# Altium project BalEv.PrjPcb
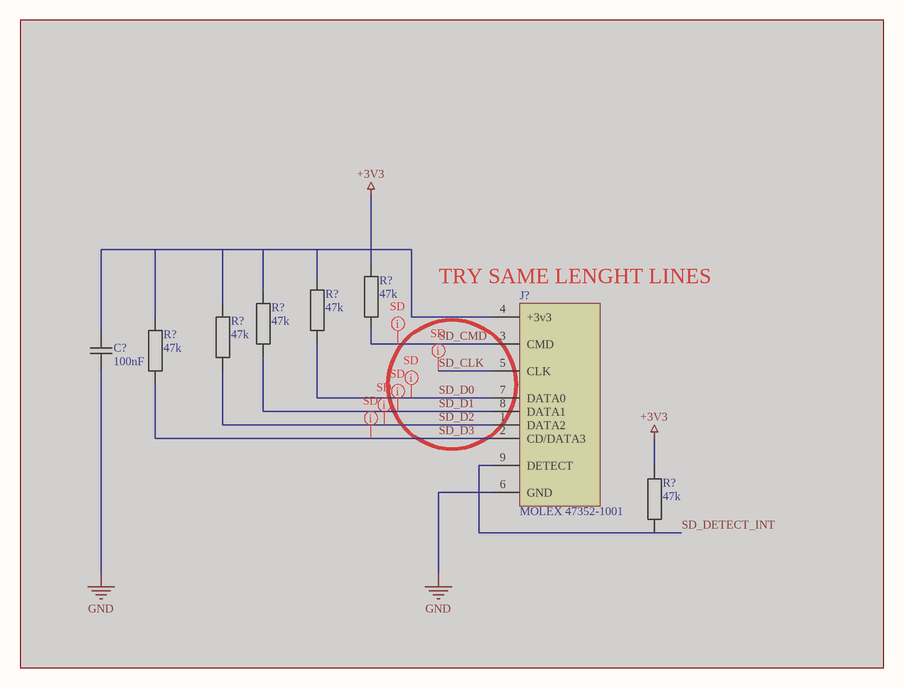
[diagram p0: BalEv_SD_card_v1_0.SchDoc]
PcbDate: 25.05.2022; PcbDesigner: gas; PcbRevision: 1.0; SchematicDate: 17.01.2022; SchematicDesigner: anx/sap; SchematicRevision: 1.0a
8 sheets, 306 parts. Net scope: global (net labels, ports and power ports of the same name join across sheets).
Board file: BalEv.PcbDoc
Sheets:
  BalEv_SD_card_v1_0.SchDoc
  BalEv_STM_v1_0.SchDoc
  BalEv_USB_v1_0.SchDoc
  BalEv_FPTG_POW_COFIG_v1_0.SchDoc
  BalEv_ADC_v1_0.SchDoc
  BalEv_AINa_v1_0.SchDoc
  BalEv_AINb_v1_0.SchDoc
  BalEv_FPTG_IO_v1_0.SchDoc

## Sheet BalEv_SD_card_v1_0.SchDoc
size A4; CompanyName: HESSO; Address1: Route du Rawyl 47; Address2: 1950 Sion; Address3: Switzerland; DocumentNumber: 5; SheetNumber: 1; SheetTotal: 8; PageSetup: Record=PageOptions|CenterHorizontal=True|CenterVertical=True|PrintScale=1.00|XCorrection=1.00|YCorrection=1.00|PrintKind=1|BorderSize=5000000|LeftOffset=0|BottomOffset=0|Orientation=2|PaperLength=1000|PaperWidth=1000|Scale=100|PaperSource=15|PrintQuality=1200|MediaType=1|DitherType=10|PrintScaleMode=1|PaperKind=A4|PaperIndex=9; ProjectName: Project Name

### Parts
(Parts that share a designator on the sheet are numbered #1, #2 ... from top to bottom, then left to right.)
C?#1  100nF  [CAPACITOR 1005 REFLOW]  (masked out: inside a compile mask, not in the netlist)
J?#1  MOLEX 47352-1001  [SD MICRO MOLEX 47352-1001]  (masked out: inside a compile mask, not in the netlist)
R?#1  47k  [RESISTOR 1005 REFLOW]  (masked out: inside a compile mask, not in the netlist)
R?#2  47k  [RESISTOR 1005 REFLOW]  (masked out: inside a compile mask, not in the netlist)
R?#3  47k  [RESISTOR 1005 REFLOW]  (masked out: inside a compile mask, not in the netlist)
R?#4  47k  [RESISTOR 1005 REFLOW]  (masked out: inside a compile mask, not in the netlist)
R?#5  47k  [RESISTOR 1005 REFLOW]  (masked out: inside a compile mask, not in the netlist)
R?#6  47k  [RESISTOR 1005 REFLOW]  (masked out: inside a compile mask, not in the netlist)

### Layout directives
net class SD; rule Matched Net Lengths [Tolerance = 1mm]: (no net found under the mark)

### Notes on the sheet
- (near J?#1) TRY SAME LENGHT LINES
- Date :
- Revision :
- Sheet
- of
- Design by :

### Library data of the parts
C?#1 = Capacitor: Value: 100nF; STOCK: NO
J?#1 = SD-MICRO MOLEX 47352-1001: SD Card  Micro 47352-1001; Value: MOLEX 47352-1001; STOCK: YES
R?#1-R?#6 = Resistor: Value: 47k; STOCK: NO

## Sheet BalEv_STM_v1_0.SchDoc
size A4; CompanyName: HESSO; Address1: Route du Rawyl 47; Address2: 1950 Sion; Address3: Switzerland; DocumentNumber: 3; SheetNumber: 2; SheetTotal: 8; PageSetup: Record=PageOptions|CenterHorizontal=True|CenterVertical=True|PrintScale=1.00|XCorrection=1.00|YCorrection=1.00|PrintKind=1|BorderSize=5000000|LeftOffset=0|BottomOffset=0|Orientation=2|PaperLength=1000|PaperWidth=1000|Scale=100|PaperSource=15|PrintQuality=1200|MediaType=1|DitherType=10|PrintScaleMode=1|PaperKind=A4|PaperIndex=9; ProjectName: Project Name
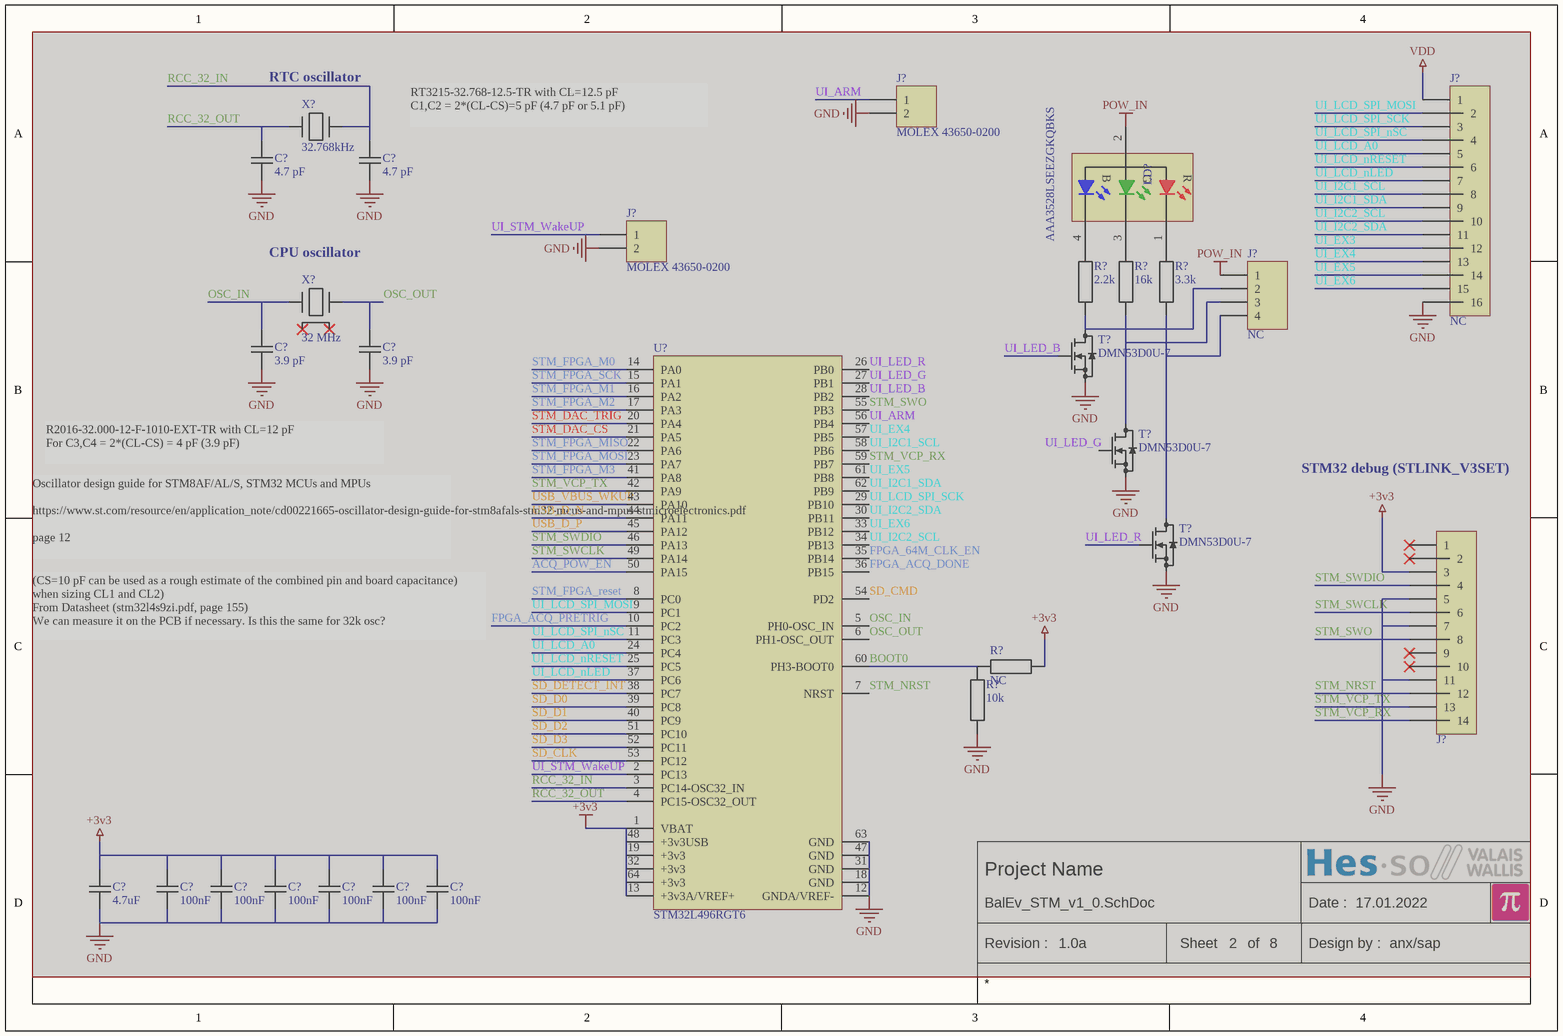
[diagram p1: BalEv_STM_v1_0.SchDoc]

### Parts
(Parts that share a designator on the sheet are numbered #1, #2 ... from top to bottom, then left to right.)
C?#2  4.7 pF  [CAPACITOR 1005 REFLOW]  (masked out: inside a compile mask, not in the netlist)
C?#3  4.7 pF  [CAPACITOR 1005 REFLOW]  (masked out: inside a compile mask, not in the netlist)
C?#4  3.9 pF  [CAPACITOR 1005 REFLOW]  (masked out: inside a compile mask, not in the netlist)
C?#5  3.9 pF  [CAPACITOR 1005 REFLOW]  (masked out: inside a compile mask, not in the netlist)
C?#6  4.7uF  [CAPACITOR 1608 REFLOW]  (masked out: inside a compile mask, not in the netlist)
C?#7  100nF  [CAPACITOR 1005 REFLOW]  (masked out: inside a compile mask, not in the netlist)
C?#8  100nF  [CAPACITOR 1005 REFLOW]  (masked out: inside a compile mask, not in the netlist)
C?#9  100nF  [CAPACITOR 1005 REFLOW]  (masked out: inside a compile mask, not in the netlist)
C?#10  100nF  [CAPACITOR 1005 REFLOW]  (masked out: inside a compile mask, not in the netlist)
C?#11  100nF  [CAPACITOR 1005 REFLOW]  (masked out: inside a compile mask, not in the netlist)
C?#12  100nF  [CAPACITOR 1005 REFLOW]  (masked out: inside a compile mask, not in the netlist)
J?#2  MOLEX 43650-0200  [MOLEX 43650-0200]  (masked out: inside a compile mask, not in the netlist)
J?#3  NC  [FlatCable2x8 2MM Right Angle TH FCI 98614-G61-16ULF]  (masked out: inside a compile mask, not in the netlist)
J?#4  MOLEX 43650-0200  [MOLEX 43650-0200]  (masked out: inside a compile mask, not in the netlist)
J?#5  NC  [MOLEX 43650-0400]  (masked out: inside a compile mask, not in the netlist)
J?#6  *  [PinHeader2x7 P1.27]  (value not drawn)  (masked out: inside a compile mask, not in the netlist)
LD?  AAA3528LSEEZGKQBKS  [LED Kingbright AAA3528LSEEZGKQBKS]  (masked out: inside a compile mask, not in the netlist)
R?#7  2.2k  [RESISTOR 1005 REFLOW]  (masked out: inside a compile mask, not in the netlist)
R?#8  16k  [RESISTOR 1005 REFLOW]  (masked out: inside a compile mask, not in the netlist)
R?#9  3.3k  [RESISTOR 1005 REFLOW]  (masked out: inside a compile mask, not in the netlist)
R?#10  10k  [RESISTOR 1005 REFLOW]  (masked out: inside a compile mask, not in the netlist)
R?#11  NC  [RESISTOR 1005 REFLOW]  (masked out: inside a compile mask, not in the netlist)
T?#1  DMN53D0U-7  [SOT23 P0.95 C1.6x3.0 H1.3]  (masked out: inside a compile mask, not in the netlist)
T?#2  DMN53D0U-7  [SOT23 P0.95 C1.6x3.0 H1.3]  (masked out: inside a compile mask, not in the netlist)
T?#3  DMN53D0U-7  [SOT23 P0.95 C1.6x3.0 H1.3]  (masked out: inside a compile mask, not in the netlist)
U?#1  STM32L496RGT6  [LQFP64 P0.5 C10.0x10.0 H1.6]  (masked out: inside a compile mask, not in the netlist)
X?#1  32.768kHz  [Crystal C3.2x1.5 Abracon ABS07]  (masked out: inside a compile mask, not in the netlist)
X?#2  32 MHz  [Crystal C2.0x1.6 Abracon ABM11W]  (masked out: inside a compile mask, not in the netlist)

### Notes on the sheet
- (near X?#1) RTC oscillator
- (near C?#3) RT3215-32.768-12.5-TR with CL=12.5 pF
  C1,C2 = 2*(CL-CS)=5 pF (4.7 pF or 5.1 pF)
- (near X?#2) CPU oscillator
- R2016-32.000-12-F-1010-EXT-TR with CL=12 pF
  For C3,C4 = 2*(CL-CS) = 4 pF (3.9 pF)
- STM32 debug (STLINK_V3SET)
- Oscillator design guide for STM8AF/AL/S, STM32 MCUs and MPUs
  https://www.st.com/resource/en/application_note/cd00221665-oscillator-design-guide-for-stm8afals-stm32-mcus-and-mpus-stmicroelectronics.pdf
  page 12
- (CS=10 pF can be used as a rough estimate of the combined pin and board capacitance) when sizing CL1 and CL2)
  From Datasheet (stm32l4s9zi.pdf, page 155)
  We can measure it on the PCB if necessary. Is this the same for 32k osc?
- Date :
- Revision :
- Sheet
- of
- Design by :

### Library data of the parts
C?#2-C?#12 = Capacitor: STOCK: NO
  C?#2 C?#3: Value: 4.7 pF
  C?#4 C?#5: Value: 3.9 pF
  C?#6: Value: 4.7uF
  C?#7-C?#12: Value: 100nF
J?#2 J?#4 = MOLEX 43650-0200: Micro-Fit 3.0 Right-Angle Header, 3.00mm Pitch, Single Row, 2 Circuits MOLEX 43650-0200
J?#3 = FlatCable2x8
J?#5 = MOLEX 43650-0400: Micro-Fit 3.0 Right-Angle Header, 3.00mm Pitch, Single Row, 4 Circuits, MOLEX 43650-0400
J?#6 = PinHeader2x7: Plug connector; Value: *; STOCK: YES
LD? = LED Kingbright AAA3528LSEEZGKQBKS: 3.5x2.8mm SURFACE MOUNT LED LAMP; Value: AAA3528LSEEZGKQBKS
R?#7-R?#11 = Resistor: STOCK: NO
  R?#7: Value: 2.2k
  R?#8: Value: 16k
  R?#9: Value: 3.3k
  R?#10: Value: 10k
  R?#11: Value: NC
T?#1-T?#3 = MOS-N SOT23 G-S-D: Generic MOS-N; Value: DMN53D0U-7
U?#1 = STM32L4X6R_T: Ultra-low-power Arm® Cortex®-M4 32-bit MCU+FPU, 100DMIPS, / up to 1MB Flash, 320KB SRAM, USB OTG FS, audio, ext. SMPS; Value: STM32L496RGT6
X?#1 = Crystal C3.2x1.5 Abracon ABS07: RT3215-32.768-12.5-TR; Value: 32.768kHz; STOCK: YES
X?#2 = Crystal C2.0x1.6 Abracon ABM11W: R2016-32.000-12-F-1010-EXT-TR; Value: 32 MHz; STOCK: YES

## Sheet BalEv_USB_v1_0.SchDoc
size A4; CompanyName: HESSO; Address1: Route du Rawyl 47; Address2: 1950 Sion; Address3: Switzerland; DocumentNumber: 6; SheetNumber: 3; SheetTotal: 8; PageSetup: Record=PageOptions|CenterHorizontal=True|CenterVertical=True|PrintScale=1.00|XCorrection=1.00|YCorrection=1.00|PrintKind=1|BorderSize=5000000|LeftOffset=0|BottomOffset=0|Orientation=2|PaperLength=1000|PaperWidth=1000|Scale=100|PaperSource=15|PrintQuality=1200|MediaType=1|DitherType=10|PrintScaleMode=1|PaperKind=A4|PaperIndex=9; ProjectName: Project Name
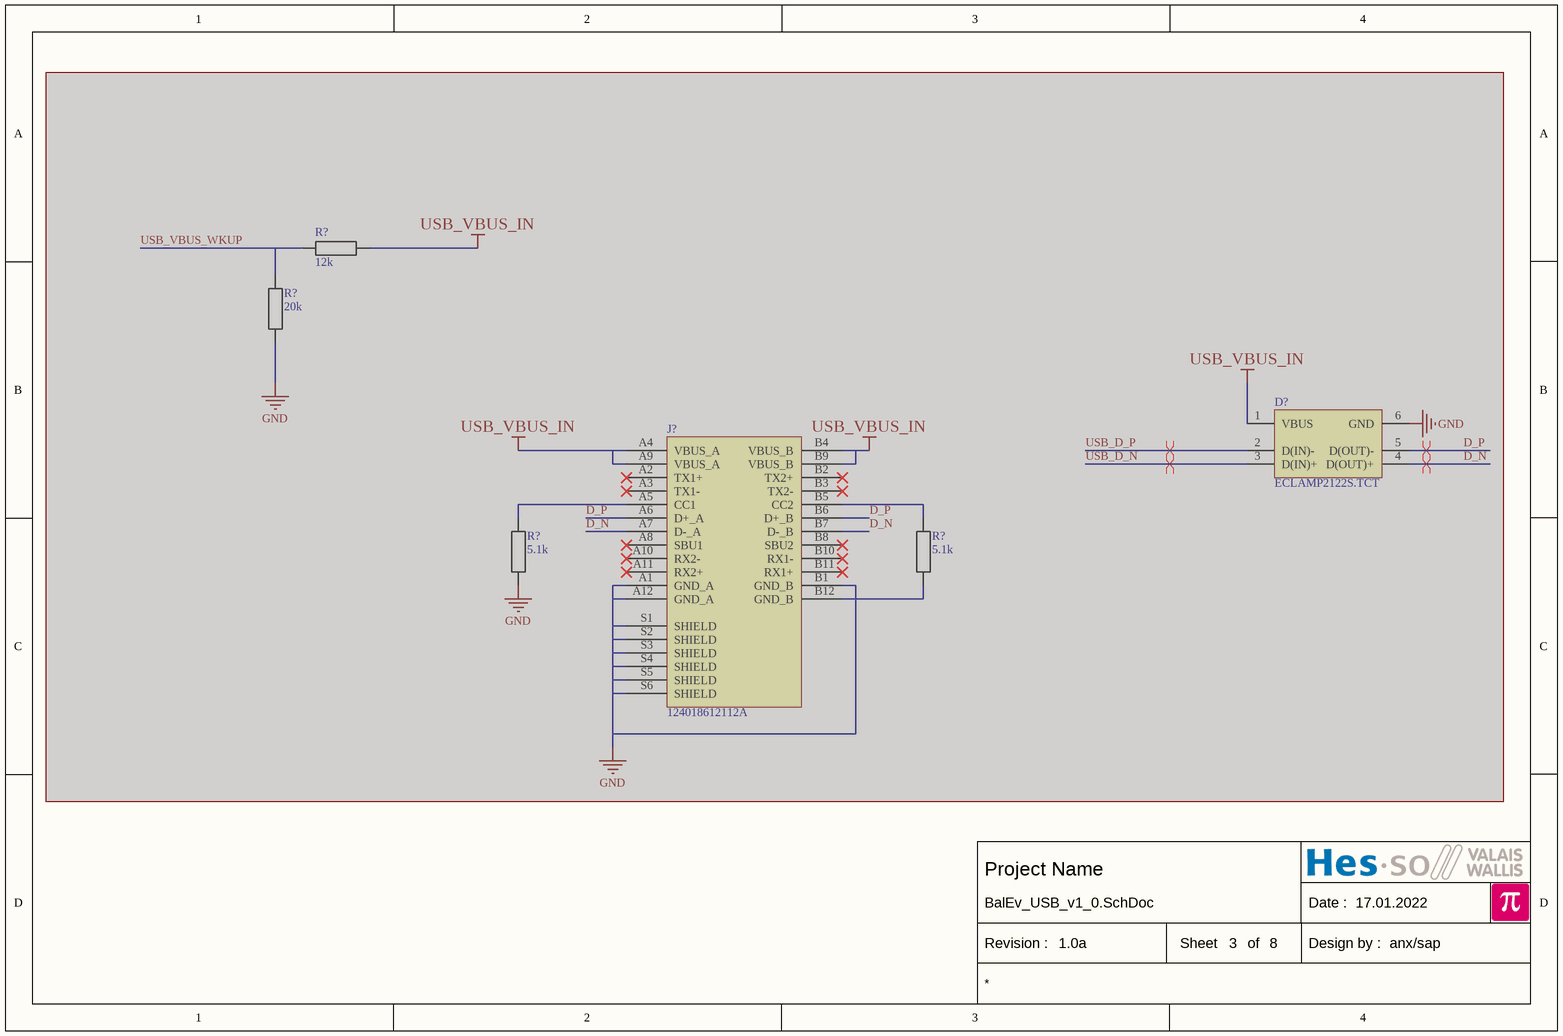
[diagram p2: BalEv_USB_v1_0.SchDoc]

### Parts
(Parts that share a designator on the sheet are numbered #1, #2 ... from top to bottom, then left to right.)
D?  ECLAMP2122S.TCT  [SOT23-6 P0.95 C1.5x3.0 H1.3]  (masked out: inside a compile mask, not in the netlist)
J?#7  124018612112A  [USB-C SMD AMPHENOL 124018612112A]  (masked out: inside a compile mask, not in the netlist)
R?#12  12k  [RESISTOR 1005 REFLOW]  (masked out: inside a compile mask, not in the netlist)
R?#13  20k  [RESISTOR 1005 REFLOW]  (masked out: inside a compile mask, not in the netlist)
R?#14  5.1k  [RESISTOR 1005 REFLOW]  (masked out: inside a compile mask, not in the netlist)
R?#15  5.1k  [RESISTOR 1005 REFLOW]  (masked out: inside a compile mask, not in the netlist)

### Layout directives
differential pair: (no net found under the mark)

### Notes on the sheet
- Date :
- Revision :
- Sheet
- of
- Design by :

### Library data of the parts
D? = Diode ARRAY ON Semi STF202-22T1G: USB Filter with ESD Protection; Value: ECLAMP2122S.TCT; STOCK: YES
J?#7 = USB-C SMD AMPHENOL 124018612112A: USB-C, USB 3.2 Gen 2 (USB 3.1 Gen 2, Superspeed + (USB 3.1)) Receptacle Connector 24 Position Surface Mount, Right Angle; Through Hole; Value: 124018612112A
R?#12-R?#15 = Resistor
  R?#12: Value: 12k; STOCK: NO
  R?#13: Value: 20k; STOCK: NO
  R?#14 R?#15: Value: 5.1k

## Sheet BalEv_FPTG_POW_COFIG_v1_0.SchDoc
size A4; CompanyName: HESSO; Address1: Route du Rawyl 47; Address2: 1950 Sion; Address3: Switzerland; DocumentNumber: 5; SheetNumber: 4; SheetTotal: 8; PageSetup: Record=PageOptions|CenterHorizontal=True|CenterVertical=True|PrintScale=1.00|XCorrection=1.00|YCorrection=1.00|PrintKind=1|BorderSize=5000000|LeftOffset=0|BottomOffset=0|Orientation=2|PaperLength=1000|PaperWidth=1000|Scale=100|PaperSource=15|PrintQuality=1200|MediaType=1|DitherType=10|PrintScaleMode=1|PaperKind=A4|PaperIndex=9; ProjectName: Project Name
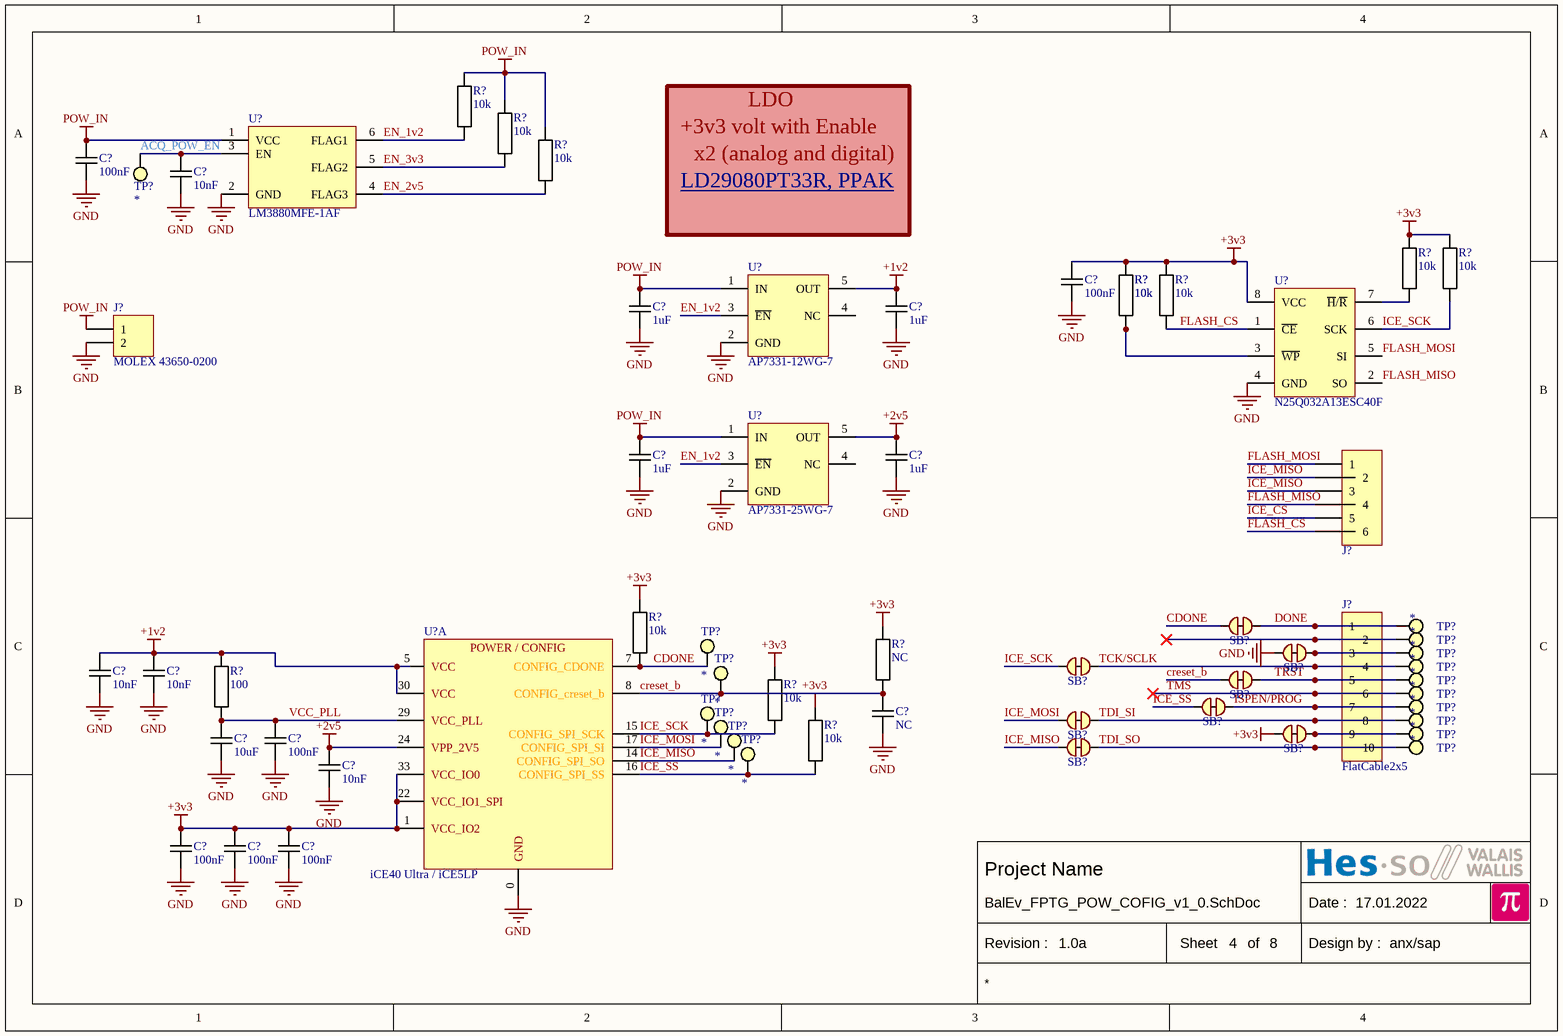
[diagram p3: BalEv_FPTG_POW_COFIG_v1_0.SchDoc]

### Parts
(Parts that share a designator on the sheet are numbered #1, #2 ... from top to bottom, then left to right.)
C?#13  100nF  [CAPACITOR 1005 REFLOW]
C?#14  10nF  [CAPACITOR 1005 REFLOW]
C?#15  100nF  [CAPACITOR 1005 REFLOW]
C?#16  1uF  [CAPACITOR 1608 REFLOW]
C?#17  1uF  [CAPACITOR 1608 REFLOW]
C?#18  1uF  [CAPACITOR 1608 REFLOW]
C?#19  1uF  [CAPACITOR 1608 REFLOW]
C?#20  10nF  [CAPACITOR 1005 REFLOW]
C?#21  10nF  [CAPACITOR 1005 REFLOW]
C?#22  NC  [CAPACITOR 1005 REFLOW]
C?#23  10uF  [CAPACITOR 1608 REFLOW]
C?#24  100nF  [CAPACITOR 1005 REFLOW]
C?#25  10nF  [CAPACITOR 1005 REFLOW]
C?#26  100nF  [CAPACITOR 1005 REFLOW]
C?#27  100nF  [CAPACITOR 1005 REFLOW]
C?#28  100nF  [CAPACITOR 1005 REFLOW]
J?#8  MOLEX 43650-0200  [MOLEX 43650-0200]
J?#9  *  [PinHeader2x3 P2.54]  (value not drawn)
J?#10  FlatCable2x5  [FlatCable2x5 2MM Straight TH FCI 98414-G06-10ULF]
R?#16  10k  [RESISTOR 1005 REFLOW]
R?#17  10k  [RESISTOR 1005 REFLOW]
R?#18  10k  [RESISTOR 1005 REFLOW]
R?#19  10k  [RESISTOR 1005 REFLOW]
R?#20  10k  [RESISTOR 1005 REFLOW]
R?#21  10k  [RESISTOR 1005 REFLOW]
R?#22  10k  [RESISTOR 1005 REFLOW]
R?#23  10k  [RESISTOR 1005 REFLOW]
R?#24  10k  [RESISTOR 1005 REFLOW]
R?#25  NC  [RESISTOR 1005 REFLOW]
R?#26  100  [RESISTOR 1005 REFLOW]
R?#27  10k  [RESISTOR 1005 REFLOW]
R?#28  10k  [RESISTOR 1005 REFLOW]
SB?#1  *  [Solder Bridge 1mm Connected]  (value not drawn)  (net tie, no BOM)
SB?#2  *  [Solder Bridge 1mm Connected]  (value not drawn)  (net tie, no BOM)
SB?#3  *  [Solder Bridge 1mm Connected]  (value not drawn)  (net tie, no BOM)
SB?#4  *  [Solder Bridge 1mm Connected]  (value not drawn)  (net tie, no BOM)
SB?#5  *  [Solder Bridge 1mm Connected]  (value not drawn)  (net tie, no BOM)
SB?#6  *  [Solder Bridge 1mm Connected]  (value not drawn)  (net tie, no BOM)
SB?#7  *  [Solder Bridge 1mm Connected]  (value not drawn)  (net tie, no BOM)
SB?#8  *  [Solder Bridge 1mm Connected]  (value not drawn)  (net tie, no BOM)
TP?#1  *  [Hole 0.25 D0.8]  (no BOM)
TP?#2  *  [Hole 0.25 D0.8]  (no BOM)
TP?#3  *  [Hole 0.25 D0.8]  (no BOM)
TP?#4  *  [Hole 0.25 D0.8]  (no BOM)
TP?#5  *  [Hole 0.25 D0.8]  (no BOM)
TP?#6  *  [Hole 0.25 D0.8]  (no BOM)
TP?#7  *  [Hole 0.25 D0.8]  (no BOM)
TP?#8  *  [Hole 0.25 D0.8]  (no BOM)
TP?#9  *  [Hole 0.25 D0.8]  (no BOM)
TP?#10  *  [Hole 0.25 D0.8]  (no BOM)
TP?#11  *  [Hole 0.25 D0.8]  (no BOM)
TP?#12  *  [Hole 0.25 D0.8]  (no BOM)
TP?#13  *  [Hole 0.25 D0.8]  (no BOM)
TP?#14  *  [Hole 0.25 D0.8]  (no BOM)
TP?#15  *  [Hole 0.25 D0.8]  (no BOM)
TP?#16  *  [Hole 0.25 D0.8]  (no BOM)
TP?#17  *  [Hole 0.25 D0.8]  (no BOM)
U?#2  LM3880MFE-1AF  [SC70-6 P0.65 C1.4x2.2 H1.0]
U?#3  AP7331-12WG-7  [SOT23-5 P0.95 C1.6x3.0 H1.3]
U?#4  N25Q032A13ESC40F  [SO8 P1.27 C4.0X5.0 H1.75]
U?#5  AP7331-25WG-7  [SOT23-5 P0.95 C1.6x3.0 H1.3]
U?#6  iCE40 Ultra / iCE5LP  [QFN50P700X700X100_HS-49N]  (part A of 4)

### Nets
+1v2: C?#17.2 C?#20.2 C?#21.2 R?#26.2 U?#3.5(OUT) U?#6.5(VCC) U?#6.30(VCC)
+2v5: C?#19.2 C?#25.2 U?#5.5(OUT) U?#6.24(VPP_2V5)
+3v3: C?#15.2 C?#26.2 C?#27.2 C?#28.2 R?#19.2 R?#20.2 R?#21.2 R?#22.2 R?#23.2 R?#24.2 R?#25.2 R?#27.2 R?#28.2 SB?#7.2 U?#4.8(VCC) U?#6.1(VCC_IO2) U?#6.22(VCC_IO1_SPI) U?#6.33(VCC_IO0)
GND: C?#13.1 C?#14.1 C?#15.1 C?#16.1 C?#17.1 C?#18.1 C?#19.1 C?#20.1 C?#21.1 C?#22.1 C?#23.1 C?#24.1 C?#25.1 C?#26.1 C?#27.1 C?#28.1 J?#8.2 SB?#2.2 U?#2.2(GND) U?#3.2(GND) U?#4.4(GND) U?#5.2(GND) U?#6.0(GND)
POW_IN: C?#13.2 C?#16.2 C?#18.2 J?#8.1 R?#16.2 R?#17.2 R?#18.2 U?#2.1(VCC) U?#3.1(IN) U?#5.1(IN)
ACQ_POW_EN: C?#14.2 TP?#1.1 U?#2.3(EN)
CDONE: R?#24.1 SB?#1.2 TP?#5.1 U?#6.7(CONFIG_CDONE)
creset_b: C?#22.2 R?#25.1 SB?#4.2 TP?#8.1 U?#6.8(CONFIG_creset_b)
DONE: J?#10.1 SB?#1.1 TP?#2.1
EN_1v2: R?#16.1 U?#2.6(FLAG1) U?#3.3(~{EN}) U?#5.3(~{EN})
EN_2v5: R?#18.1 U?#2.4(FLAG3)
EN_3v3: R?#17.1 U?#2.5(FLAG2)
FLASH_CS: J?#9.6 R?#23.1 U?#4.1(~{CE})
FLASH_MISO: J?#9.4 U?#4.2(SO)
FLASH_MOSI: J?#9.1 U?#4.5(SI)
ICE_CS: J?#9.5
ICE_MISO: J?#9.2 J?#9.3 SB?#8.2 TP?#16.1 U?#6.14(CONFIG_SPI_SO)
ICE_MOSI: SB?#6.2 TP?#14.1 U?#6.17(CONFIG_SPI_SI)
ICE_SCK: R?#20.1 R?#27.1 SB?#3.2 TP?#12.1 U?#4.6(SCK) U?#6.15(CONFIG_SPI_SCK)
ICE_SS: R?#28.1 SB?#5.2 TP?#17.1 U?#6.16(CONFIG_SPI_SS)
ISPEN/PROG: J?#10.7 SB?#5.1 TP?#10.1
TCK/SCLK: J?#10.4 SB?#3.1 TP?#6.1
TDI_SI: J?#10.8 SB?#6.1 TP?#11.1
TDI_SO: J?#10.10 SB?#8.1 TP?#15.1
TMS: J?#10.6 TP?#9.1
TRST: J?#10.5 SB?#4.1 TP?#7.1
VCC_PLL: C?#23.2 C?#24.2 R?#26.1 U?#6.29(VCC_PLL)
NetJ?#10_2: J?#10.2 TP?#3.1
NetJ?#10_3: J?#10.3 SB?#2.1 TP?#4.1
NetJ?#10_9: J?#10.9 SB?#7.1 TP?#13.1
NetR?#19_1: R?#19.1 U?#4.7(~{H}/~{R})
NetR?#21_1: R?#21.1 R?#22.1 U?#4.3(~{WP})

Not connected (* = marked no-connect by the designer): U?#3 4(NC); U?#5 4(NC)

### Notes on the sheet
- LDO
- +3v3 volt with Enable
- x2 (analog and digital)
- LD29080PT33R, PPAK <https://www.st.com/content/ccc/resource/technical/document/datasheet/b1/ba/31/d4/6e/d9/46/02/CD00044919.pdf/files/CD00044919.pdf/jcr:content/translations/en.CD00044919.pdf>
- Date :
- Revision :
- Sheet
- of
- Design by :
- (in symbol ICE5LP1K-SG48, part A) POWER / CONFIG

### Library data of the parts
C?#13-C?#28 = Capacitor
  C?#13 C?#15 C?#24 C?#26-C?#28: Value: 100nF
  C?#14 C?#20 C?#21 C?#25: Value: 10nF
  C?#16-C?#19: Value: 1uF
  C?#22: Value: NC
  C?#23: Value: 10uF
J?#8 = MOLEX 43650-0200: Micro-Fit 3.0 Right-Angle Header, 3.00mm Pitch, Single Row, 2 Circuits
J?#9 = PinHeader2x3: Plug connector; Value: *
J?#10 = FlatCable2x5: FlatCable2x5 (FCS-12-SG, FCS-10-SG, MHR-10-VUAL)
R?#16-R?#28 = Resistor
  R?#16-R?#24 R?#27 R?#28: Value: 10k
  R?#25: Value: NC
  R?#26: Value: 100
SB?#1-SB?#8 = Solderbridge Connected: Value: *
TP?#1-TP?#17 = Hole: Value: *
U?#2 = LM3880MF-1__: Three-Rail Simple Power Supply Sequencer; Value: LM3880MFE-1AF
U?#3 U?#5 = REGPOS SOT23-5 IN,GND,EN,NC,OUT: Generic Positive Voltage Regulator
  U?#3: Value: AP7331-12WG-7
  U?#5: Value: AP7331-25WG-7
U?#4 = IS25LP064D-JB: 32Mb Serial Flash Memory; Value: N25Q032A13ESC40F
U?#6 = ICE5LP1K-SG48

## Sheet BalEv_ADC_v1_0.SchDoc
size A4; CompanyName: HESSO; Address1: Route du Rawyl 47; Address2: 1950 Sion; Address3: Switzerland; DocumentNumber: 3; SheetNumber: 5; SheetTotal: 8; PageSetup: Record=PageOptions|CenterHorizontal=True|CenterVertical=True|PrintScale=1.00|XCorrection=1.00|YCorrection=1.00|PrintKind=1|BorderSize=5000000|LeftOffset=0|BottomOffset=0|Orientation=2|PaperLength=1000|PaperWidth=1000|Scale=100|PaperSource=15|PrintQuality=1200|MediaType=1|DitherType=10|PrintScaleMode=1|PaperKind=A4|PaperIndex=9; ProjectName: Project Name
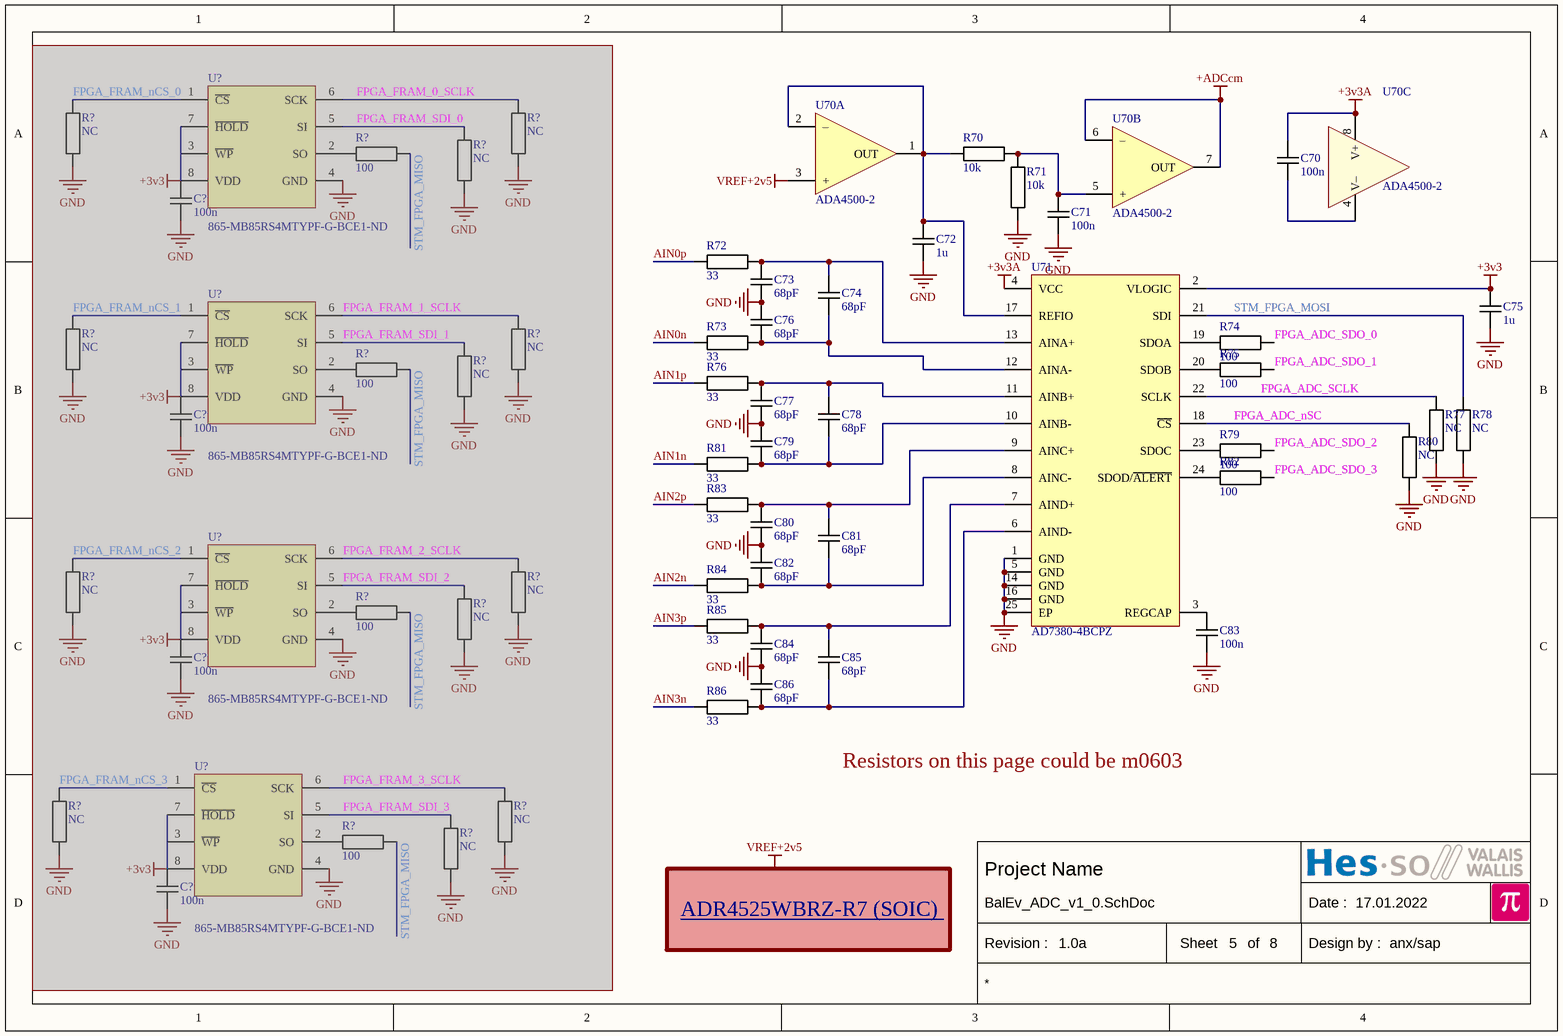
[diagram p4: BalEv_ADC_v1_0.SchDoc]

### Parts
(Parts that share a designator on the sheet are numbered #1, #2 ... from top to bottom, then left to right.)
C70  100n  [CAPACITOR 1005 REFLOW]
C71  100n  [CAPACITOR 1005 REFLOW]
C72  1u  [CAPACITOR 1005 REFLOW]
C73  68pF  [CAPACITOR 1005 REFLOW]
C74  68pF  [CAPACITOR 1005 REFLOW]
C75  1u  [CAPACITOR 1005 REFLOW]
C76  68pF  [CAPACITOR 1005 REFLOW]
C77  68pF  [CAPACITOR 1005 REFLOW]
C78  68pF  [CAPACITOR 1005 REFLOW]
C79  68pF  [CAPACITOR 1005 REFLOW]
C80  68pF  [CAPACITOR 1005 REFLOW]
C81  68pF  [CAPACITOR 1005 REFLOW]
C82  68pF  [CAPACITOR 1005 REFLOW]
C83  100n  [CAPACITOR 1005 REFLOW]
C84  68pF  [CAPACITOR 1005 REFLOW]
C85  68pF  [CAPACITOR 1005 REFLOW]
C86  68pF  [CAPACITOR 1005 REFLOW]
C?#29  100n  [CAPACITOR 1005 REFLOW]  (masked out: inside a compile mask, not in the netlist)
C?#30  100n  [CAPACITOR 1005 REFLOW]  (masked out: inside a compile mask, not in the netlist)
C?#31  100n  [CAPACITOR 1005 REFLOW]  (masked out: inside a compile mask, not in the netlist)
C?#32  100n  [CAPACITOR 1005 REFLOW]  (masked out: inside a compile mask, not in the netlist)
R70  10k  [RESISTOR 1608 REFLOW]
R71  10k  [RESISTOR 1608 REFLOW]
R72  33  [RESISTOR 1005 REFLOW]
R73  33  [RESISTOR 1005 REFLOW]
R74  100  [RESISTOR 1005 REFLOW]
R75  100  [RESISTOR 1005 REFLOW]
R76  33  [RESISTOR 1005 REFLOW]
R77  NC  [RESISTOR 1005 REFLOW]
R78  NC  [RESISTOR 1005 REFLOW]
R79  100  [RESISTOR 1005 REFLOW]
R80  NC  [RESISTOR 1005 REFLOW]
R81  33  [RESISTOR 1005 REFLOW]
R82  100  [RESISTOR 1005 REFLOW]
R83  33  [RESISTOR 1005 REFLOW]
R84  33  [RESISTOR 1005 REFLOW]
R85  33  [RESISTOR 1005 REFLOW]
R86  33  [RESISTOR 1005 REFLOW]
R?#29  100  [RESISTOR 1005 REFLOW]  (masked out: inside a compile mask, not in the netlist)
R?#30  NC  [RESISTOR 1005 REFLOW]  (masked out: inside a compile mask, not in the netlist)
R?#31  NC  [RESISTOR 1005 REFLOW]  (masked out: inside a compile mask, not in the netlist)
R?#32  NC  [RESISTOR 1005 REFLOW]  (masked out: inside a compile mask, not in the netlist)
R?#33  100  [RESISTOR 1005 REFLOW]  (masked out: inside a compile mask, not in the netlist)
R?#34  NC  [RESISTOR 1005 REFLOW]  (masked out: inside a compile mask, not in the netlist)
R?#35  NC  [RESISTOR 1005 REFLOW]  (masked out: inside a compile mask, not in the netlist)
R?#36  NC  [RESISTOR 1005 REFLOW]  (masked out: inside a compile mask, not in the netlist)
R?#37  100  [RESISTOR 1005 REFLOW]  (masked out: inside a compile mask, not in the netlist)
R?#38  NC  [RESISTOR 1005 REFLOW]  (masked out: inside a compile mask, not in the netlist)
R?#39  NC  [RESISTOR 1005 REFLOW]  (masked out: inside a compile mask, not in the netlist)
R?#40  NC  [RESISTOR 1005 REFLOW]  (masked out: inside a compile mask, not in the netlist)
R?#41  100  [RESISTOR 1005 REFLOW]  (masked out: inside a compile mask, not in the netlist)
R?#42  NC  [RESISTOR 1005 REFLOW]  (masked out: inside a compile mask, not in the netlist)
R?#43  NC  [RESISTOR 1005 REFLOW]  (masked out: inside a compile mask, not in the netlist)
R?#44  NC  [RESISTOR 1005 REFLOW]  (masked out: inside a compile mask, not in the netlist)
U70  ADA4500-2  [MSOP8 P0.65 C3.0X3.0 H1.1]  (parts A,B,C of 3)
U71  AD7380-4BCPZ  [QFN24 P0.5 T0.5x0.5 C4.0x4.0 H0.6]
U?#7  865-MB85RS4MTYPF-G-BCE1-ND  [SO8W P1.27 C5.0X5.0 H2.0]  (masked out: inside a compile mask, not in the netlist)
U?#8  865-MB85RS4MTYPF-G-BCE1-ND  [SO8W P1.27 C5.0X5.0 H2.0]  (masked out: inside a compile mask, not in the netlist)
U?#9  865-MB85RS4MTYPF-G-BCE1-ND  [SO8W P1.27 C5.0X5.0 H2.0]  (masked out: inside a compile mask, not in the netlist)
U?#10  865-MB85RS4MTYPF-G-BCE1-ND  [SO8W P1.27 C5.0X5.0 H2.0]  (masked out: inside a compile mask, not in the netlist)

### Nets
+3v3: C75.2 U71.2(VLOGIC)
+3v3A: C70.2 U70.8(V+) U71.4(VCC)
+ADCcm: U70.6(–) U70.7(OUT)
GND: C71.1 C72.1 C73.2 C75.1 C76.1 C77.2 C79.1 C80.2 C82.1 C83.1 C84.2 C86.1 R71.1 R77.1 R78.1 R80.1 U71.1(GND) U71.5(GND) U71.14(GND) U71.16(GND) U71.25(EP)
VREF+2v5: U70.3(+)
AIN0n: R73.1
AIN0p: R72.1
AIN1n: R81.1
AIN1p: R76.1
AIN2n: R84.1
AIN2p: R83.1
AIN3n: R86.1
AIN3p: R85.1
FPGA_ADC_nSC: R80.2 U71.18(~{CS})
FPGA_ADC_SCLK: R77.2 U71.22(SCLK)
FPGA_ADC_SDO_0: R74.2
FPGA_ADC_SDO_1: R75.2
FPGA_ADC_SDO_2: R79.2
FPGA_ADC_SDO_3: R82.2
STM_FPGA_MOSI: R78.2 U71.21(SDI)
NetC70_1: C70.1 U70.4(V–)
NetC71_2: C71.2 R70.2 R71.2 U70.5(+)
NetC72_2: C72.2 R70.1 U70.1(OUT) U70.2(–) U71.17(REFIO)
NetC73_1: C73.1 C74.2 R72.2 U71.13(AINA+)
NetC74_1: C74.1 C76.2 R73.2 U71.12(AINA-)
NetC77_1: C77.1 C78.2 R76.2 U71.11(AINB+)
NetC78_1: C78.1 C79.2 R81.2 U71.10(AINB-)
NetC80_1: C80.1 C81.2 R83.2 U71.9(AINC+)
NetC81_1: C81.1 C82.2 R84.2 U71.8(AINC-)
NetC83_2: C83.2 U71.3(REGCAP)
NetC84_1: C84.1 C85.2 R85.2 U71.7(AIND+)
NetC85_1: C85.1 C86.2 R86.2 U71.6(AIND-)
NetR74_1: R74.1 U71.19(SDOA)
NetR75_1: R75.1 U71.20(SDOB)
NetR79_1: R79.1 U71.23(SDOC)
NetR82_1: R82.1 U71.24(SDOD/~{ALERT})

### Notes on the sheet
- Resistors on this page could be m0603
- ADR4525WBRZ-R7 (SOIC) <https://www.analog.com/media/en/technical-documentation/data-sheets/ADR4520_4525_4530_4533_4540_4550.pdf>
- Labels drawn without touching a wire or pin: VREF+2v5
- Date :
- Revision :
- Sheet
- of
- Design by :

### Library data of the parts
C70-C86 C?#29-C?#32 = Capacitor
  C70 C71 C83 C?#29-C?#32: Value: 100n
  C72 C75: Value: 1u
  C73 C74 C76-C82 C84-C86: Value: 68pF
R70 R71 = Resistor: Resistor 0.01% (RNCF0603TKW10K0); Value: 10k
R72-R86 R?#29-R?#44 = Resistor
  R72 R73 R76 R81 R83-R86: Value: 33
  R74 R75 R79 R82 R?#29 R?#33 R?#37 R?#41: Value: 100
  R77 R78 R80 R?#30-R?#32 R?#34-R?#36 R?#38-R?#40 R?#42-R?#44: Value: NC
U70 = OPA DUAL: Generic dual OPA 8 pins; Value: ADA4500-2
U71 = AD7380-4BCPZ: Differential Input, Quad, External Reference / Simultaneous Sampling, 16-Bit, SAR ADC; Value: AD7380-4BCPZ
U?#7-U?#10 = FM25V20A-G: 2-Mbit (256 K × 8) Serial (SPI) F-RAM; Value: 865-MB85RS4MTYPF-G-BCE1-ND

## Sheet BalEv_AINa_v1_0.SchDoc
size A3; CompanyName: HESSO; Address1: Route du Rawyl 47; Address2: 1950 Sion; Address3: Switzerland; DocumentNumber: 3; SheetNumber: 6; SheetTotal: 8; PageSetup: Record=PageOptions|CenterHorizontal=True|CenterVertical=True|PrintScale=1.00|XCorrection=1.00|YCorrection=1.00|PrintKind=1|BorderSize=5000000|LeftOffset=0|BottomOffset=0|Orientation=2|PaperLength=1000|PaperWidth=1000|Scale=100|PaperSource=15|PrintQuality=1200|MediaType=1|DitherType=10|PrintScaleMode=1|PaperKind=A4|PaperIndex=9; ProjectName: Project Name
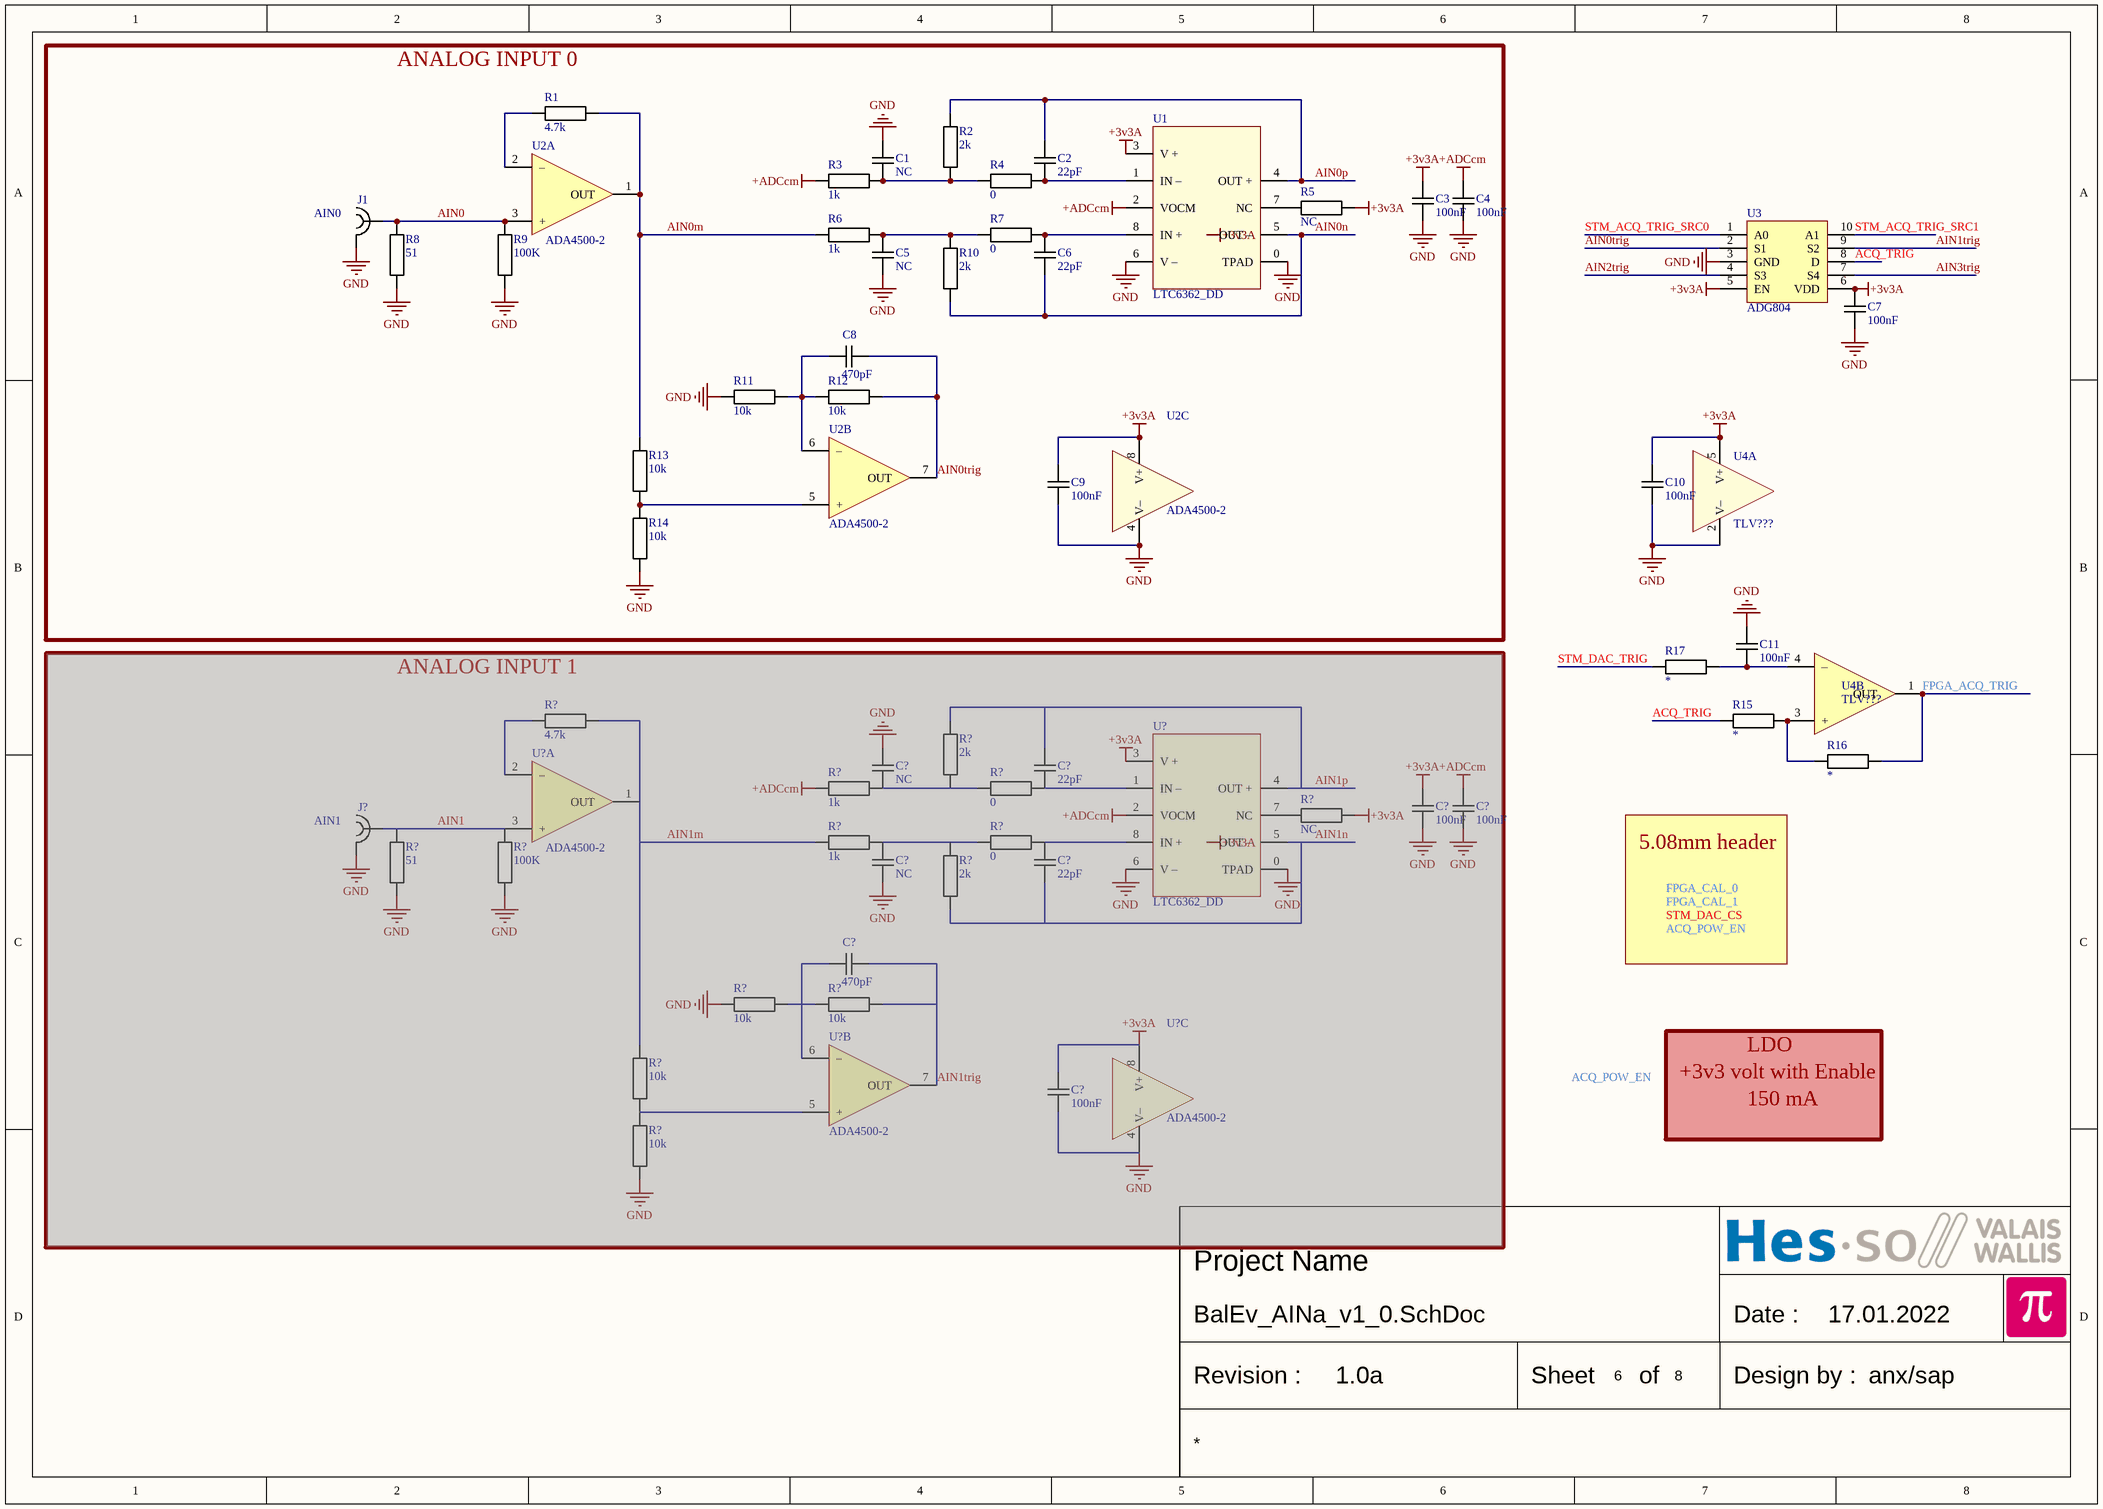
[diagram p5: BalEv_AINa_v1_0.SchDoc]

### Parts
(Parts that share a designator on the sheet are numbered #1, #2 ... from top to bottom, then left to right.)
C1  NC  [CAPACITOR 1005 REFLOW]
C2  22pF  [CAPACITOR 1005 REFLOW]
C3  100nF  [CAPACITOR 1005 REFLOW]
C4  100nF  [CAPACITOR 1005 REFLOW]
C5  NC  [CAPACITOR 1005 REFLOW]
C6  22pF  [CAPACITOR 1005 REFLOW]
C7  100nF  [CAPACITOR 1005 REFLOW]
C8  470pF  [CAPACITOR 1005 REFLOW]
C9  100nF  [CAPACITOR 1005 REFLOW]
C10  100nF  [CAPACITOR 1005 REFLOW]
C11  100nF  [CAPACITOR 1005 REFLOW]
C?#33  NC  [CAPACITOR 1005 REFLOW]  (masked out: inside a compile mask, not in the netlist)
C?#34  22pF  [CAPACITOR 1005 REFLOW]  (masked out: inside a compile mask, not in the netlist)
C?#35  100nF  [CAPACITOR 1005 REFLOW]  (masked out: inside a compile mask, not in the netlist)
C?#36  100nF  [CAPACITOR 1005 REFLOW]  (masked out: inside a compile mask, not in the netlist)
C?#37  NC  [CAPACITOR 1005 REFLOW]  (masked out: inside a compile mask, not in the netlist)
C?#38  22pF  [CAPACITOR 1005 REFLOW]  (masked out: inside a compile mask, not in the netlist)
C?#39  470pF  [CAPACITOR 1005 REFLOW]  (masked out: inside a compile mask, not in the netlist)
C?#40  100nF  [CAPACITOR 1005 REFLOW]  (masked out: inside a compile mask, not in the netlist)
J1  AIN0  [SMA EDGE Molex 732511150]
J?#11  AIN1  [SMA EDGE Molex 732511150]  (masked out: inside a compile mask, not in the netlist)
R1  4.7k  [RESISTOR 1005 REFLOW]
R2  2k  [RESISTOR 1005 REFLOW]
R3  1k  [RESISTOR 1005 REFLOW]
R4  0  [RESISTOR 1005 REFLOW]
R5  NC  [RESISTOR 1005 REFLOW]
R6  1k  [RESISTOR 1005 REFLOW]
R7  0  [RESISTOR 1005 REFLOW]
R8  51  [RESISTOR 1005 REFLOW]
R9  100K  [RESISTOR 1005 REFLOW]
R10  2k  [RESISTOR 1005 REFLOW]
R11  10k  [RESISTOR 1005 REFLOW]
R12  10k  [RESISTOR 1005 REFLOW]
R13  10k  [RESISTOR 1005 REFLOW]
R14  10k  [RESISTOR 1005 REFLOW]
R15  *  [RESISTOR 1005 REFLOW]
R16  *  [RESISTOR 1005 REFLOW]
R17  *  [RESISTOR 1005 REFLOW]
R?#45  4.7k  [RESISTOR 1005 REFLOW]  (masked out: inside a compile mask, not in the netlist)
R?#46  1k  [RESISTOR 1005 REFLOW]  (masked out: inside a compile mask, not in the netlist)
R?#47  2k  [RESISTOR 1005 REFLOW]  (masked out: inside a compile mask, not in the netlist)
R?#48  0  [RESISTOR 1005 REFLOW]  (masked out: inside a compile mask, not in the netlist)
R?#49  NC  [RESISTOR 1005 REFLOW]  (masked out: inside a compile mask, not in the netlist)
R?#50  1k  [RESISTOR 1005 REFLOW]  (masked out: inside a compile mask, not in the netlist)
R?#51  2k  [RESISTOR 1005 REFLOW]  (masked out: inside a compile mask, not in the netlist)
R?#52  0  [RESISTOR 1005 REFLOW]  (masked out: inside a compile mask, not in the netlist)
R?#53  51  [RESISTOR 1005 REFLOW]  (masked out: inside a compile mask, not in the netlist)
R?#54  100K  [RESISTOR 1005 REFLOW]  (masked out: inside a compile mask, not in the netlist)
R?#55  10k  [RESISTOR 1005 REFLOW]  (masked out: inside a compile mask, not in the netlist)
R?#56  10k  [RESISTOR 1005 REFLOW]  (masked out: inside a compile mask, not in the netlist)
R?#57  10k  [RESISTOR 1005 REFLOW]  (masked out: inside a compile mask, not in the netlist)
R?#58  10k  [RESISTOR 1005 REFLOW]  (masked out: inside a compile mask, not in the netlist)
U1  LTC6362_DD  [LFCSP8 P0.5 C3.0x2.8 H1.0]
U2  ADA4500-2  [MSOP8 P0.65 C3.0X3.0 H1.1]  (parts A,B,C of 3)
U3  ADG804  [TSSOP50P490X110-10N]
U4  TLV???  [SOT23-5 P0.95 C1.6x3.0 H1.3]  (parts A,B of 2)
U?#11  LTC6362_DD  [LFCSP8 P0.5 C3.0x2.8 H1.0]  (masked out: inside a compile mask, not in the netlist)
U?#12  ADA4500-2  [MSOP8 P0.65 C3.0X3.0 H1.1]  (part A of 3)  (masked out: inside a compile mask, not in the netlist)
U?#13  ADA4500-2  [MSOP8 P0.65 C3.0X3.0 H1.1]  (part C of 3)  (masked out: inside a compile mask, not in the netlist)
U?#14  ADA4500-2  [MSOP8 P0.65 C3.0X3.0 H1.1]  (part B of 3)  (masked out: inside a compile mask, not in the netlist)

### Blocks framed on the sheet
ANALOG INPUT 0: C1-C6 C8 C9 J1 R1-R14 U1 U2
ANALOG INPUT 1: C?#33-C?#40 J?#11 R?#45-R?#58 U?#11-U?#14

### Nets
+3v3A: C3.2 C7.1 C9.1 C10.1 R5.2 U1.3(V_+) U2.8(V+) U3.5(EN) U3.6(VDD) U4.5(V+)
+ADCcm: C4.2 R3.1 U1.2(VOCM)
GND: C1.1 C3.1 C4.1 C5.2 C7.2 C9.2 C10.2 C11.1 J1.2 R8.1 R9.1 R11.1 R14.2 U1.0(TPAD) U1.6(V_–) U2.4(V–) U3.3(GND) U4.2(V–)
ACQ_TRIG: R15.2 U3.8(D)
AIN0: J1.1 R8.2 R9.2 U2.3(+)
AIN0m: R1.2 R6.1 R13.1 U2.1(OUT)
AIN0n: C6.1 R10.2 U1.5(OUT_–)
AIN0p: C2.1 R2.2 U1.4(OUT_+)
AIN0trig: C8.1 R12.2 U2.7(OUT) U3.2(S1)
AIN1trig: U3.9(S2)
AIN2trig: U3.4(S3)
AIN3trig: U3.7(S4)
FPGA_ACQ_TRIG: R16.1 U4.1(OUT)
STM_ACQ_TRIG_SRC0: U3.1(A0)
STM_ACQ_TRIG_SRC1: U3.10(A1)
STM_DAC_TRIG: R17.2
NetC1_2: C1.2 R2.1 R3.2 R4.2
NetC2_2: C2.2 R4.1 U1.1(IN_–)
NetC5_1: C5.1 R6.2 R7.1 R10.1
NetC6_2: C6.2 R7.2 U1.8(IN_+)
NetC8_2: C8.2 R11.2 R12.1 U2.6(–)
NetC11_2: C11.2 R17.1 U4.4(–)
NetR1_1: R1.1 U2.2(–)
NetR5_1: R5.1 U1.7(NC)
NetR13_2: R13.2 R14.1 U2.5(+)
NetR15_1: R15.1 R16.2 U4.3(+)

### Notes on the sheet
- 5.08mm header
- LDO
- +3v3 volt with Enable
- 150 mA
- Labels drawn without touching a wire or pin: +3v3A, ACQ_POW_EN, FPGA_CAL_0, FPGA_CAL_1, STM_DAC_CS
- Date :
- Revision :
- Sheet
- of
- Design by :

### Library data of the parts
C1-C11 C?#33-C?#40 = Capacitor
  C1 C5 C?#33 C?#37: Value: NC
  C2 C6 C?#34 C?#38: Value: 22pF
  C3 C4 C7 C9-C11 C?#35 C?#36 C?#40: Value: 100nF
  C8 C?#39: Value: 470pF
J1 J?#11 = SMA EDGE Molex 732511150
  J1: Value: AIN0
  J?#11: Value: AIN1
R1-R17 R?#45-R?#58 = Resistor
  R1 R?#45: Value: 4.7k
  R2 R10 R?#47 R?#51: Value: 2k
  R3 R6 R?#46 R?#50: Value: 1k
  R4 R7 R?#48 R?#52: Value: 0
  R5 R?#49: Value: NC
  R8 R?#53: Value: 51
  R9 R?#54: Value: 100K
  R11-R14 R?#55-R?#58: Value: 10k
  R15-R17: Value: *
U1 U?#11 = AD8139ACP: IC OPAMP DIFF 410MHZ RRO 8LFCSP; Value: LTC6362_DD
U2 U?#12-U?#14 = OPA DUAL: Generic dual OPA 8 pins; Value: ADA4500-2
U4 = COMPARATOR SINGLE SOT23-5: Generic Single Comparator 5pins 1OUT/2-V/3+IN/4-IN/5+V; Value: TLV???

## Sheet BalEv_AINb_v1_0.SchDoc
size A3; CompanyName: HESSO; Address1: Route du Rawyl 47; Address2: 1950 Sion; Address3: Switzerland; DocumentNumber: 3; SheetNumber: 7; SheetTotal: 8; PageSetup: Record=PageOptions|CenterHorizontal=True|CenterVertical=True|PrintScale=1.00|XCorrection=1.00|YCorrection=1.00|PrintKind=1|BorderSize=5000000|LeftOffset=0|BottomOffset=0|Orientation=2|PaperLength=1000|PaperWidth=1000|Scale=100|PaperSource=15|PrintQuality=1200|MediaType=1|DitherType=10|PrintScaleMode=1|PaperKind=A4|PaperIndex=9; ProjectName: Project Name
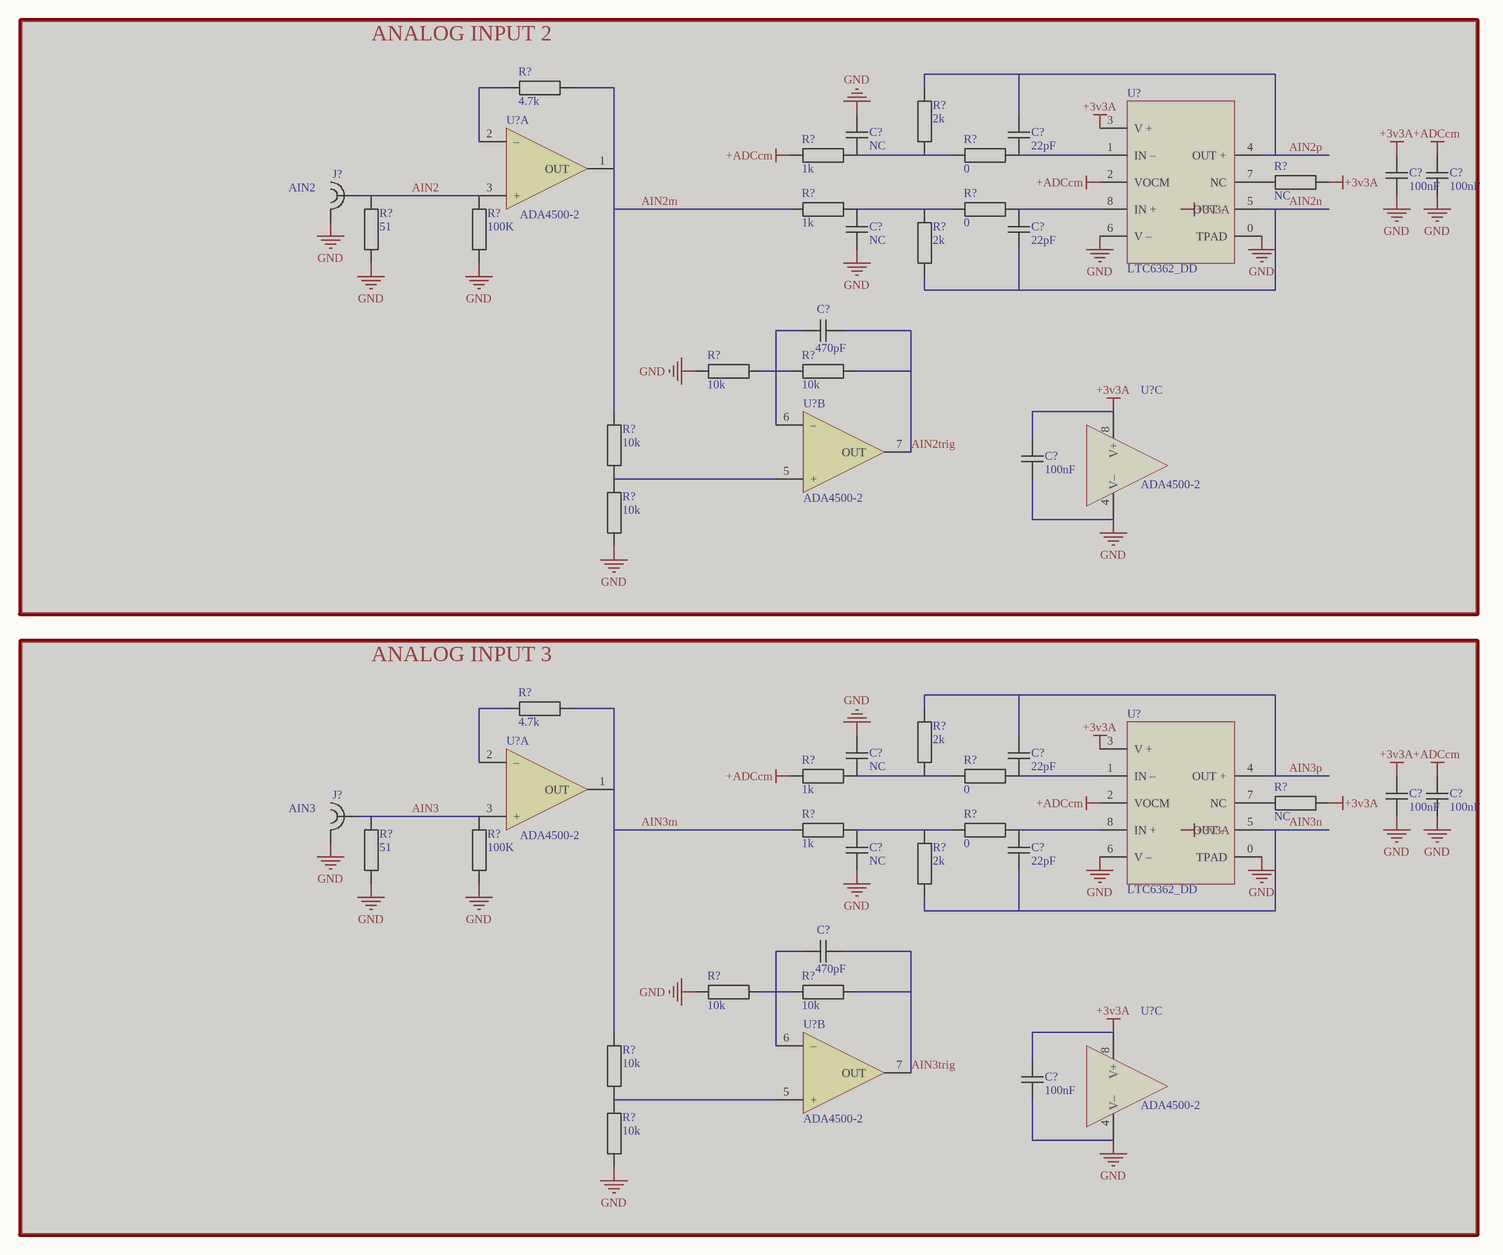
[diagram p6: BalEv_AINb_v1_0.SchDoc]

### Parts
(Parts that share a designator on the sheet are numbered #1, #2 ... from top to bottom, then left to right.)
C?#41  NC  [CAPACITOR 1005 REFLOW]  (masked out: inside a compile mask, not in the netlist)
C?#42  22pF  [CAPACITOR 1005 REFLOW]  (masked out: inside a compile mask, not in the netlist)
C?#43  100nF  [CAPACITOR 1005 REFLOW]  (masked out: inside a compile mask, not in the netlist)
C?#44  100nF  [CAPACITOR 1005 REFLOW]  (masked out: inside a compile mask, not in the netlist)
C?#45  NC  [CAPACITOR 1005 REFLOW]  (masked out: inside a compile mask, not in the netlist)
C?#46  22pF  [CAPACITOR 1005 REFLOW]  (masked out: inside a compile mask, not in the netlist)
C?#47  470pF  [CAPACITOR 1005 REFLOW]  (masked out: inside a compile mask, not in the netlist)
C?#48  100nF  [CAPACITOR 1005 REFLOW]  (masked out: inside a compile mask, not in the netlist)
C?#49  NC  [CAPACITOR 1005 REFLOW]  (masked out: inside a compile mask, not in the netlist)
C?#50  22pF  [CAPACITOR 1005 REFLOW]  (masked out: inside a compile mask, not in the netlist)
C?#51  100nF  [CAPACITOR 1005 REFLOW]  (masked out: inside a compile mask, not in the netlist)
C?#52  100nF  [CAPACITOR 1005 REFLOW]  (masked out: inside a compile mask, not in the netlist)
C?#53  NC  [CAPACITOR 1005 REFLOW]  (masked out: inside a compile mask, not in the netlist)
C?#54  22pF  [CAPACITOR 1005 REFLOW]  (masked out: inside a compile mask, not in the netlist)
C?#55  470pF  [CAPACITOR 1005 REFLOW]  (masked out: inside a compile mask, not in the netlist)
C?#56  100nF  [CAPACITOR 1005 REFLOW]  (masked out: inside a compile mask, not in the netlist)
J?#12  AIN2  [SMA EDGE Molex 732511150]  (masked out: inside a compile mask, not in the netlist)
J?#13  AIN3  [SMA EDGE Molex 732511150]  (masked out: inside a compile mask, not in the netlist)
R?#59  4.7k  [RESISTOR 1005 REFLOW]  (masked out: inside a compile mask, not in the netlist)
R?#60  1k  [RESISTOR 1005 REFLOW]  (masked out: inside a compile mask, not in the netlist)
R?#61  2k  [RESISTOR 1005 REFLOW]  (masked out: inside a compile mask, not in the netlist)
R?#62  0  [RESISTOR 1005 REFLOW]  (masked out: inside a compile mask, not in the netlist)
R?#63  NC  [RESISTOR 1005 REFLOW]  (masked out: inside a compile mask, not in the netlist)
R?#64  1k  [RESISTOR 1005 REFLOW]  (masked out: inside a compile mask, not in the netlist)
R?#65  2k  [RESISTOR 1005 REFLOW]  (masked out: inside a compile mask, not in the netlist)
R?#66  0  [RESISTOR 1005 REFLOW]  (masked out: inside a compile mask, not in the netlist)
R?#67  51  [RESISTOR 1005 REFLOW]  (masked out: inside a compile mask, not in the netlist)
R?#68  100K  [RESISTOR 1005 REFLOW]  (masked out: inside a compile mask, not in the netlist)
R?#69  10k  [RESISTOR 1005 REFLOW]  (masked out: inside a compile mask, not in the netlist)
R?#70  10k  [RESISTOR 1005 REFLOW]  (masked out: inside a compile mask, not in the netlist)
R?#71  10k  [RESISTOR 1005 REFLOW]  (masked out: inside a compile mask, not in the netlist)
R?#72  10k  [RESISTOR 1005 REFLOW]  (masked out: inside a compile mask, not in the netlist)
R?#73  4.7k  [RESISTOR 1005 REFLOW]  (masked out: inside a compile mask, not in the netlist)
R?#74  1k  [RESISTOR 1005 REFLOW]  (masked out: inside a compile mask, not in the netlist)
R?#75  2k  [RESISTOR 1005 REFLOW]  (masked out: inside a compile mask, not in the netlist)
R?#76  0  [RESISTOR 1005 REFLOW]  (masked out: inside a compile mask, not in the netlist)
R?#77  NC  [RESISTOR 1005 REFLOW]  (masked out: inside a compile mask, not in the netlist)
R?#78  1k  [RESISTOR 1005 REFLOW]  (masked out: inside a compile mask, not in the netlist)
R?#79  2k  [RESISTOR 1005 REFLOW]  (masked out: inside a compile mask, not in the netlist)
R?#80  0  [RESISTOR 1005 REFLOW]  (masked out: inside a compile mask, not in the netlist)
R?#81  51  [RESISTOR 1005 REFLOW]  (masked out: inside a compile mask, not in the netlist)
R?#82  100K  [RESISTOR 1005 REFLOW]  (masked out: inside a compile mask, not in the netlist)
R?#83  10k  [RESISTOR 1005 REFLOW]  (masked out: inside a compile mask, not in the netlist)
R?#84  10k  [RESISTOR 1005 REFLOW]  (masked out: inside a compile mask, not in the netlist)
R?#85  10k  [RESISTOR 1005 REFLOW]  (masked out: inside a compile mask, not in the netlist)
R?#86  10k  [RESISTOR 1005 REFLOW]  (masked out: inside a compile mask, not in the netlist)
U?#15  LTC6362_DD  [LFCSP8 P0.5 C3.0x2.8 H1.0]  (masked out: inside a compile mask, not in the netlist)
U?#16  ADA4500-2  [MSOP8 P0.65 C3.0X3.0 H1.1]  (part A of 3)  (masked out: inside a compile mask, not in the netlist)
U?#17  ADA4500-2  [MSOP8 P0.65 C3.0X3.0 H1.1]  (part C of 3)  (masked out: inside a compile mask, not in the netlist)
U?#18  ADA4500-2  [MSOP8 P0.65 C3.0X3.0 H1.1]  (part B of 3)  (masked out: inside a compile mask, not in the netlist)
U?#19  LTC6362_DD  [LFCSP8 P0.5 C3.0x2.8 H1.0]  (masked out: inside a compile mask, not in the netlist)
U?#20  ADA4500-2  [MSOP8 P0.65 C3.0X3.0 H1.1]  (part A of 3)  (masked out: inside a compile mask, not in the netlist)
U?#21  ADA4500-2  [MSOP8 P0.65 C3.0X3.0 H1.1]  (part C of 3)  (masked out: inside a compile mask, not in the netlist)
U?#22  ADA4500-2  [MSOP8 P0.65 C3.0X3.0 H1.1]  (part B of 3)  (masked out: inside a compile mask, not in the netlist)

### Blocks framed on the sheet
ANALOG INPUT 2: C?#41-C?#48 J?#12 R?#59-R?#72 U?#15-U?#18
ANALOG INPUT 3: C?#49-C?#56 J?#13 R?#73-R?#86 U?#19-U?#22

### Notes on the sheet
- Date :
- Revision :
- Sheet
- of
- Design by :

### Library data of the parts
C?#41-C?#56 = Capacitor
  C?#41 C?#45 C?#49 C?#53: Value: NC
  C?#42 C?#46 C?#50 C?#54: Value: 22pF
  C?#43 C?#44 C?#48 C?#51 C?#52 C?#56: Value: 100nF
  C?#47 C?#55: Value: 470pF
J?#12 J?#13 = SMA EDGE Molex 732511150
  J?#12: Value: AIN2
  J?#13: Value: AIN3
R?#59-R?#86 = Resistor
  R?#59 R?#73: Value: 4.7k
  R?#60 R?#64 R?#74 R?#78: Value: 1k
  R?#61 R?#65 R?#75 R?#79: Value: 2k
  R?#62 R?#66 R?#76 R?#80: Value: 0
  R?#63 R?#77: Value: NC
  R?#67 R?#81: Value: 51
  R?#68 R?#82: Value: 100K
  R?#69-R?#72 R?#83-R?#86: Value: 10k
U?#15 U?#19 = AD8139ACP: IC OPAMP DIFF 410MHZ RRO 8LFCSP; Value: LTC6362_DD
U?#16-U?#18 U?#20-U?#22 = OPA DUAL: Generic dual OPA 8 pins; Value: ADA4500-2

## Sheet BalEv_FPTG_IO_v1_0.SchDoc
size A4; CompanyName: HESSO; Address1: Route du Rawyl 47; Address2: 1950 Sion; Address3: Switzerland; DocumentNumber: 5; SheetNumber: 8; SheetTotal: 8; PageSetup: Record=PageOptions|CenterHorizontal=True|CenterVertical=True|PrintScale=1.00|XCorrection=1.00|YCorrection=1.00|PrintKind=1|BorderSize=5000000|LeftOffset=0|BottomOffset=0|Orientation=2|PaperLength=1000|PaperWidth=1000|Scale=100|PaperSource=15|PrintQuality=1200|MediaType=1|DitherType=10|PrintScaleMode=1|PaperKind=A4|PaperIndex=9; ProjectName: Project Name
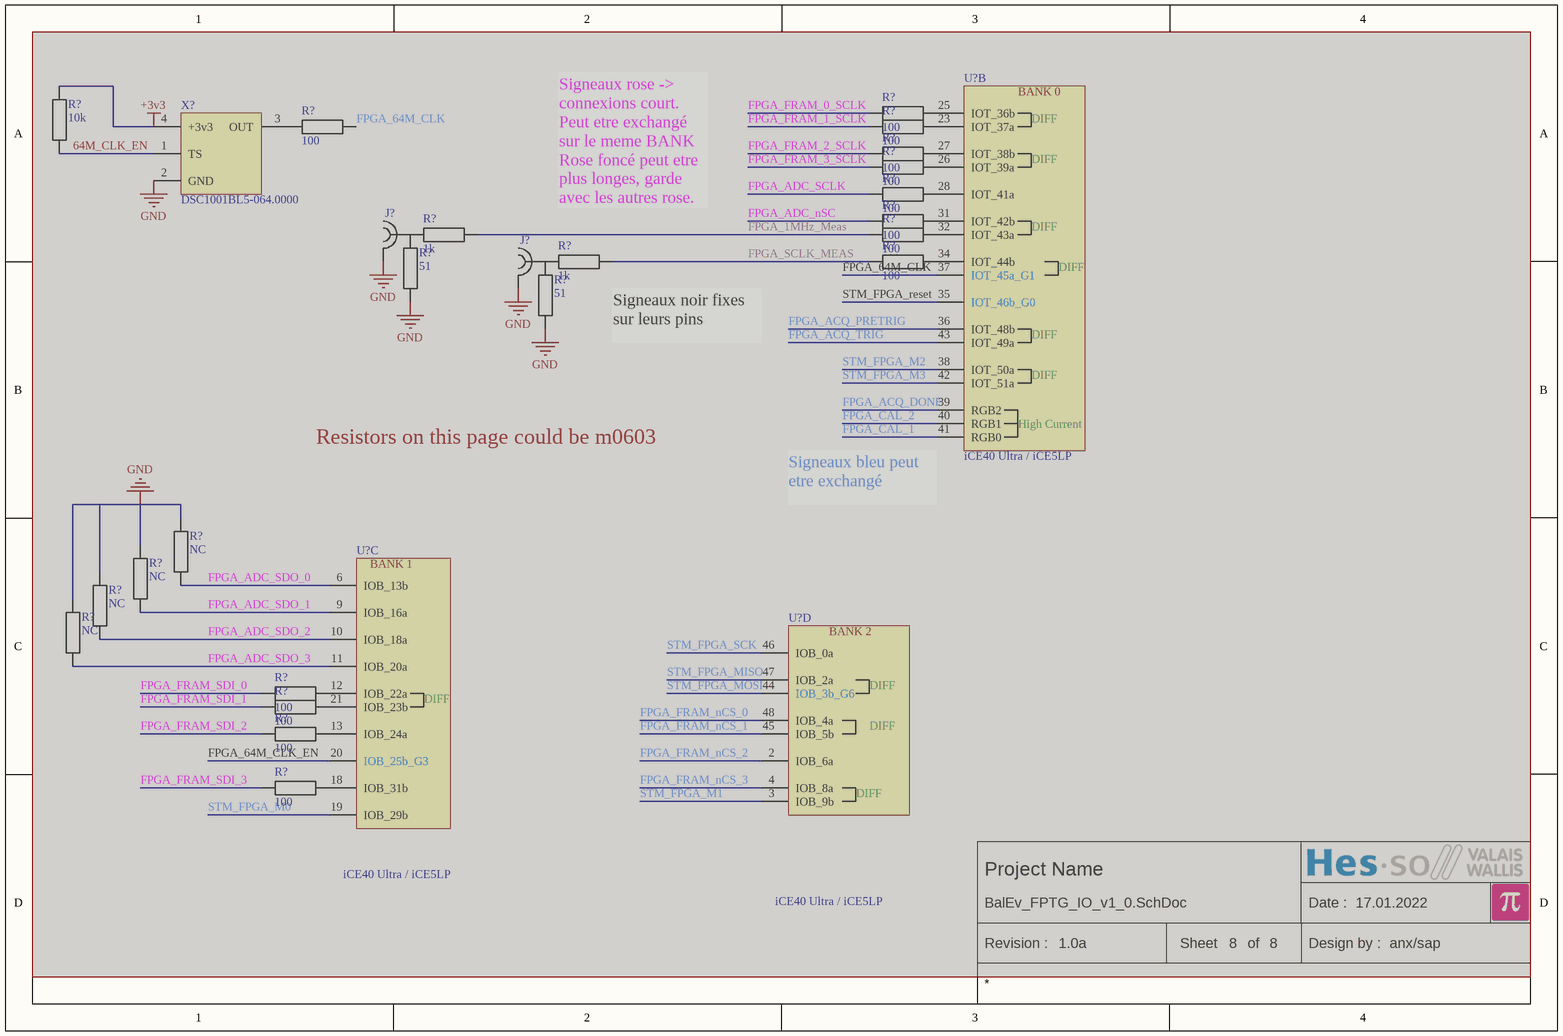
[diagram p7: BalEv_FPTG_IO_v1_0.SchDoc]

### Parts
(Parts that share a designator on the sheet are numbered #1, #2 ... from top to bottom, then left to right.)
J?#14  CONSMA001-SMD-G  [SMA SMD Vertical Linx CONSMA001-SMD-G]  (value not drawn)  (masked out: inside a compile mask, not in the netlist)
J?#15  CONSMA001-SMD-G  [SMA SMD Vertical Linx CONSMA001-SMD-G]  (value not drawn)  (masked out: inside a compile mask, not in the netlist)
R?#87  100  [RESISTOR 1005 REFLOW]  (masked out: inside a compile mask, not in the netlist)
R?#88  100  [RESISTOR 1005 REFLOW]  (masked out: inside a compile mask, not in the netlist)
R?#89  100  [RESISTOR 1005 REFLOW]  (masked out: inside a compile mask, not in the netlist)
R?#90  10k  [RESISTOR 1005 REFLOW]  (masked out: inside a compile mask, not in the netlist)
R?#91  100  [RESISTOR 1005 REFLOW]  (masked out: inside a compile mask, not in the netlist)
R?#92  100  [RESISTOR 1005 REFLOW]  (masked out: inside a compile mask, not in the netlist)
R?#93  100  [RESISTOR 1005 REFLOW]  (masked out: inside a compile mask, not in the netlist)
R?#94  100  [RESISTOR 1005 REFLOW]  (masked out: inside a compile mask, not in the netlist)
R?#95  51  [RESISTOR 1005 REFLOW]  (masked out: inside a compile mask, not in the netlist)
R?#96  1k  [RESISTOR 1005 REFLOW]  (masked out: inside a compile mask, not in the netlist)
R?#97  100  [RESISTOR 1005 REFLOW]  (masked out: inside a compile mask, not in the netlist)
R?#98  51  [RESISTOR 1005 REFLOW]  (masked out: inside a compile mask, not in the netlist)
R?#99  1k  [RESISTOR 1005 REFLOW]  (masked out: inside a compile mask, not in the netlist)
R?#100  100  [RESISTOR 1005 REFLOW]  (masked out: inside a compile mask, not in the netlist)
R?#101  NC  [RESISTOR 1005 REFLOW]  (masked out: inside a compile mask, not in the netlist)
R?#102  NC  [RESISTOR 1005 REFLOW]  (masked out: inside a compile mask, not in the netlist)
R?#103  NC  [RESISTOR 1005 REFLOW]  (masked out: inside a compile mask, not in the netlist)
R?#104  NC  [RESISTOR 1005 REFLOW]  (masked out: inside a compile mask, not in the netlist)
R?#105  100  [RESISTOR 1005 REFLOW]  (masked out: inside a compile mask, not in the netlist)
R?#106  100  [RESISTOR 1005 REFLOW]  (masked out: inside a compile mask, not in the netlist)
R?#107  100  [RESISTOR 1005 REFLOW]  (masked out: inside a compile mask, not in the netlist)
R?#108  100  [RESISTOR 1005 REFLOW]  (masked out: inside a compile mask, not in the netlist)
U?#23  iCE40 Ultra / iCE5LP  [QFN50P700X700X100_HS-49N]  (part B of 4)  (masked out: inside a compile mask, not in the netlist)
U?#24  iCE40 Ultra / iCE5LP  [QFN50P700X700X100_HS-49N]  (part C of 4)  (masked out: inside a compile mask, not in the netlist)
U?#25  iCE40 Ultra / iCE5LP  [QFN50P700X700X100_HS-49N]  (part D of 4)  (masked out: inside a compile mask, not in the netlist)
X?#3  DSC1001BL5-064.0000  [Oscillator C5.0x3.2 Abracon ASFL1]  (masked out: inside a compile mask, not in the netlist)

### Notes on the sheet
- Signeaux rose -> connexions court. Peut etre exchangé sur le meme BANK
  Rose foncé peut etre plus longes, garde avec les autres rose.
- (near R?#99) Signeaux noir fixes sur leurs pins
- Resistors on this page could be m0603
- (near U?#23) Signeaux bleu peut etre exchangé
- Date :
- Revision :
- Sheet
- of
- Design by :
- (in symbol ICE5LP1K-SG48, part B) BANK 0; DIFF; High Current
- (in symbol ICE5LP1K-SG48, part C) BANK 1; DIFF
- (in symbol ICE5LP1K-SG48, part D) BANK 2; DIFF

### Library data of the parts
J?#14 J?#15 = SMA SMD VERTICAL LINX CONSMA001-SMD-G: SMA TH VERTICAL LINX CONSMA001-SMD-G; Value: CONSMA001-SMD-G
R?#87-R?#108 = Resistor
  R?#87-R?#89 R?#91-R?#94 R?#97 R?#100 R?#105-R?#108: Value: 100
  R?#90: Value: 10k
  R?#95 R?#98: Value: 51
  R?#96 R?#99: Value: 1k
  R?#101-R?#104: Value: NC
U?#23-U?#25 = ICE5LP1K-SG48
X?#3 = Oscillator C5.0x3.2 Abracon ASFL1: Value: DSC1001BL5-064.0000

## Nets that join several sheets
+3v3: BalEv_FPTG_POW_COFIG_v1_0 (18 pins), BalEv_ADC_v1_0 (C75.2 U71.2)
+3v3A: BalEv_ADC_v1_0 (C70.2 U70.8 U71.4), BalEv_AINa_v1_0 (10 pins)
+ADCcm: BalEv_ADC_v1_0 (U70.6 U70.7), BalEv_AINa_v1_0 (C4.2 R3.1 U1.2)
GND: BalEv_FPTG_POW_COFIG_v1_0 (23 pins), BalEv_ADC_v1_0 (21 pins), BalEv_AINa_v1_0 (18 pins)
AIN0n: BalEv_ADC_v1_0 (R73.1), BalEv_AINa_v1_0 (C6.1 R10.2 U1.5)
AIN0p: BalEv_ADC_v1_0 (R72.1), BalEv_AINa_v1_0 (C2.1 R2.2 U1.4)